# Altium schematic sheet Sheet1.SchDoc
size A; SheetNumber: 1; SheetTotal: 1
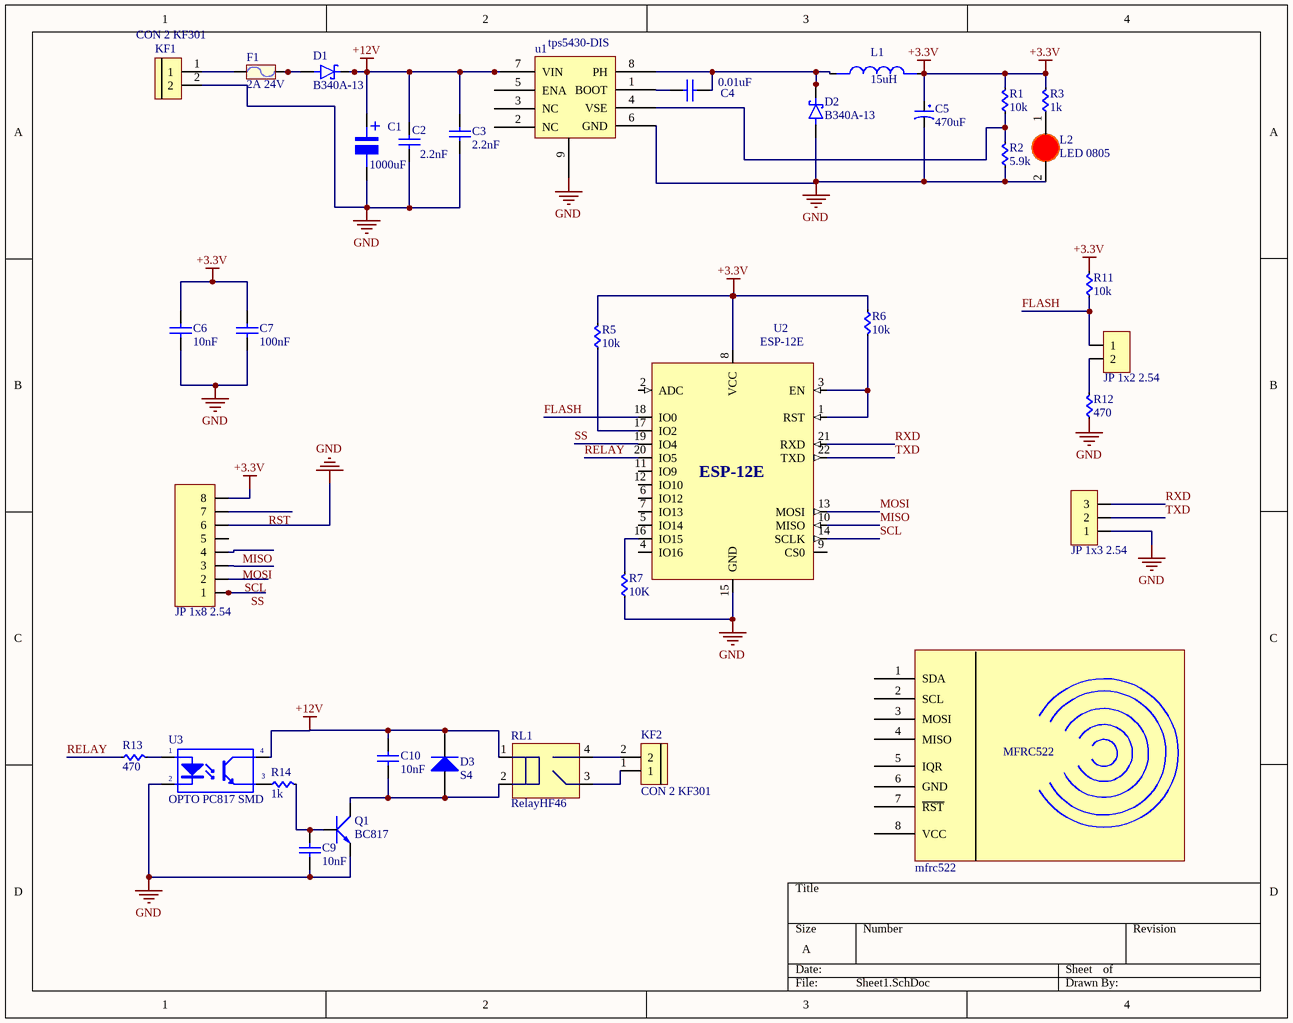
[diagram p0: Sheet1.SchDoc]

## Parts
(Parts that share a designator on the sheet are numbered #1, #2 ... from top to bottom, then left to right.)
?  mfrc522  [MFRC522]
C1  1000uF  [tu nhom 10 (G)]
C2  2.2nF  [tu 0805]
C3  2.2nF  [tu 0805]
C4  0.01uF  [tu 0805]
C5  470uF  [tu tantalum smd7343]
C6  10nF  [tu 0805]
C7  100nF  [tu 0805]
C9  10nF  [tu 0805]
C10  10nF  [tu 0805]
D1  B340A-13  [B340A]
D2  B340A-13  [B340A]
D3  S4  [DIODE SOD-123]
F1  2A 24V  [Cau chi tu phuc hoi 2A 24V SMD1812]
JP1  JP 1x3 2.54  [JP 1x3 DT]
JP?#1  JP 1x2 2.54  [JP 1x2 DT]
JP?#2  JP 1x8 2.54  [JP 1x8 DT]
KF1  CON 2 KF301  [Con 2 KF301 5.08]
KF2  CON 2 KF301  [Con 2 KF301 5.08]
L1  15uH  [CUON CAM SMD 0530]
L2  LED 0805  [LED-0805-Red]
Q1  BC817  [SOT-23]
R1  10k  [RES 0805]
R2  5.9k  [RES 0805]
R3  1k  [RES 0805]
R5  10k  [RES 0805]
R6  10k  [RES 0805]
R7  10K  [RES 0805]
R11  10k  [RES 0805]
R12  470  [RES 0805]
R13  470  [RES 0805]
R14  1k  [RES 0805]
RL1  RelayHF46  [Relay 4 chan HF46F]
u1  tps5430-DIS  [SOIC127P600X170_HS-8N]
U2  ESP-12E  [ESP-12E]
U3  OPTO PC817 SMD  [SOP4]

## Nets
+3.3V: C5.1 C6.1 C7.1 JP?#2.8 L1.2 R1.2 R3.2 R5.2 R6.1 R11.2 U2.8(VCC)
+12V: C1.1 C2.1 C3.1 C10.1 D1.C D3.2(K) RL1.1 u1.7(VIN) U3.4(C)
GND: C1.2 C2.2 C3.2 C5.2 C6.2 C7.2 C9.2 D2.A JP1.1 JP?#2.6 KF1.2 L2.2(K) Q1.2(E) R2.1 R7.1 R12.1 u1.6(GND) u1.9 U2.15(GND) U3.2(K)
FLASH: JP?#1.1 R11.1 U2.18(IO0)
MISO: JP?#2.4 U2.10(MISO)
MOSI: JP?#2.3 U2.13(MOSI)
RELAY: R13.1 U2.20(IO5)
RST: JP?#2.7
RXD: JP1.3 U2.21(RXD)
SCL: JP?#2.2 U2.14(SCLK)
SS: JP?#2.1 U2.19(IO4)
TXD: JP1.2 U2.22(TXD)
NetC4_1: C4.1 D2.C L1.1 u1.8(PH)
NetC4_2: C4.2 u1.1(BOOT)
NetC9_1: C9.1 Q1.1(B) R14.2
NetC10_2: C10.2 D3.1(A) Q1.3(C) RL1.2
NetD1_A: D1.A F1.2
NetF1_1: F1.1 KF1.1
NetJP?#1_2: JP?#1.2 R12.2
NetKF2_1: KF2.1 RL1.3(AC/DC)
NetKF2_2: KF2.2 RL1.4(AC/DC)
NetL2_1: L2.1(A) R3.1
NetR1_1: R1.1 R2.2 u1.4(VSE)
NetR5_1: R5.1 U2.17(IO2)
NetR6_2: R6.2 U2.1(RST) U2.3(EN)
NetR7_2: R7.2 U2.16(IO15)
NetR13_2: R13.2 U3.1(A)
NetR14_1: R14.1 U3.3(E)

Not connected (* = marked no-connect by the designer): ? 1(SDA) 2(SCL) 3(MOSI) 4(MISO) 5(IQR) 6(GND) 7(~{RST}) 8(VCC); JP?#2 5; u1 2(NC) 3(NC) 5(ENA); U2 2(ADC) 4(IO16) 5(IO14) 6(IO12) 7(IO13) 9(CS0) 11(IO9) 12(IO10)

## Notes on the sheet
- (in symbol mfrc522) MFRC522
- (in symbol Tu Nhom 1000uF 16V) +

## Library data of the parts
C1 = Tu Nhom 1000uF 16V: Dán; Don_Vi: Con; So_Chan: 2; Ten_Linh_Kien: Tụ Nhôm 1000uF 16V 10x10MM; Ma_Hang: MH004419; Chung_Loai: Dán; Kieu_Chan: *
C2 C3 C6 C7 C9 C10 = Tu 0805 22nF 50V 20%: Dán; Don_Vi: Con; So_Chan: 2; Ten_Linh_Kien: Tụ 0805 22nF 50V 20%; Ma_Hang: MH007857; Chung_Loai: Dán; Kieu_Chan: *
C4 = Tu 0805 15pF 50V 10%: Dán; Don_Vi: Con; So_Chan: 2; Ten_Linh_Kien: Tụ 0805 15P 10% 50V; Ma_Hang: MH004556; Chung_Loai: Dán; Kieu_Chan: *
C5 = Tu tantalum 470uF 10V SMD7343: Dán; Don_Vi: Con; So_Chan: 2; Ten_Linh_Kien: Tụ tantalum 477A-470uF 10V SMD7343; Ma_Hang: MH001956; Chung_Loai: Dán; Kieu_Chan: *
D1 D2 = B340A-13: Diode Schottky 40 V 3A Surface Mount SMA; MF: Diodes Inc.; Value: *; MP: B340A-13; Package: DO-214 Diodes Inc.; Availability: In Stock; Price: None; SnapEDA_Link: https://www.snapeda.com/parts/B340A-13/Diodes+Inc./view-part/?ref=snap; Check_prices: https://www.snapeda.com/parts/B340A-13/Diodes+Inc./view-part/?ref=eda; Purchase-URL: https://pricing.snapeda.com/search/part/B340A-13/?ref=eda
D3 = Diode S4: Dán; Ten_Linh_Kien: Diode S4 SOD123 ( 1N5819 SOD123); Ma_Hang: MH005519; Don_Vi: Con; Ghi_Chu: *; Chung_Loai: Dán; Kieu_Chan: *
F1 = Cau chi tu phuc hoi 2A 24V SMD1812: 2A 24V SMD1812; Ma_Hang: MH010033; Ten: Cầu Chì Tự Phục Hồi 2A 24V SMD1812
JP1 = JP 1x3 2.54 Duc Thang: Cắm; Ten_Linh_Kien: Jump Đơn Đực 2.54MM 1x40P Thẳng 11MM; Don_Vi: Con; Ma_Hang: MH000903; Ghi_Chu: *; Kieu_Chan: *; Chung_Loai: Cắm
JP?#1 = JP 1x2 2.54 Duc Thang: Cắm; Ten_Linh_Kien: Jump Đơn Đực 2.54MM 1x40P Thẳng 11MM; Don_Vi: Con; Ma_Hang: MH000903; Ghi_Chu: *; Kieu_Chan: *; Chung_Loai: Cắm
JP?#2 = JP 1x8 2.54 Duc Thang: Cắm; Ten_Linh_Kien: Jump Đơn Đực 2.54MM 1x40P Thẳng 11MM; Don_Vi: Con; Ma_Hang: MH000903; Ghi_Chu: *; Kieu_Chan: *; Chung_Loai: Cắm
KF1 KF2 = CON 2 KF301: Cắm; Ma_Hang: MH000987; Ten_Linh_Kien: CON 2 KF301-2P 5.08MM Xanh Dương; Chung_Loai: Cắm; Ghi_Chu: *; Kieu_Chan: *; Don_Vi: Con
L1 = Cuon Cam SMD 0530: SMD 0530; MP: FDV0530-H-1R5M=P3; Package: None; Price: None; Value: *; Availability: Unavailable
L2 = LED 0805 Do: Dán; Don_Vi: Con; Ma_Hang: MH000897; Ten_Linh_Kien: LED 0805 Màu Đỏ (Red); Ghi_Chu: *; Kieu_Chan: *; Chung_Loai: Dán
Q1 = Trans BC817: SOT-23 - C8658; Value: C9014
R1 R5-R7 R11 = RES 0805: RES SMD 0805; Manufacturer: Vishay Dale; Manufacturer Part Number: CRCW040210K0FKED; Tolerance: ±1%; Power (Watts): 0.063W, 1/16W; Temperature Coefficient: ±100ppm/°C; Supplier 1: Digi-Key; RoHS: RoHS Compliant; Category: Resistors; Stock 1: 2392462; Pricing 1: 10=0.083, 50=0.0444, 200=0.0255, 1000=0.0174 (USD); Packaging: Cut Tape (CT); Resistance (Ohms): 10k; Composition: Thick Film; Features: Automotive AEC-Q200; Operating Temperature: -55°C ~ 155°C; Package / Case: 0402 (1005 Metric); Supplier Device Package: 0402 (1005 Metric); Size / Dimension: 0.039" L x 0.020" W (1.00mm x 0.50mm); Height: 0.016" (0.40mm); Number of Terminations: 2; ComponentLink1URL: http://www.vishay.com/docs/20035/dcrcwe3.pdf; ComponentLink1Description: http://www.vishay.com/docs/20035/dcrcwe3.pdf; Supplier Part Number 1: 541-10.0KLCT-ND
R2 R3 R12-R14 = RES 0805: RES SMD 0805; Manufacturer: Vishay Dale; Manufacturer Part Number: CRCW040210K0FKED; Resistance (Ohms): 10k; Tolerance: ±1%; Power (Watts): 0.063W, 1/16W; Temperature Coefficient: ±100ppm/°C; Supplier 1: Digi-Key; RoHS: RoHS Compliant; Category: Resistors; Stock 1: 2392462; Pricing 1: 10=0.083, 50=0.0444, 200=0.0255, 1000=0.0174 (USD); Packaging: Cut Tape (CT); Composition: Thick Film; Features: Automotive AEC-Q200; Operating Temperature: -55°C ~ 155°C; Package / Case: 0402 (1005 Metric); Supplier Device Package: 0402 (1005 Metric); Size / Dimension: 0.039" L x 0.020" W (1.00mm x 0.50mm); Height: 0.016" (0.40mm); Number of Terminations: 2; ComponentLink1URL: http://www.vishay.com/docs/20035/dcrcwe3.pdf; ComponentLink1Description: http://www.vishay.com/docs/20035/dcrcwe3.pdf; Supplier Part Number 1: 541-10.0KLCT-ND
RL1 = Relay 4 chan HF46F: Ten: Relay 5V5A HF46F-G 5-HS1; Ma_Hang: MH003879
U2 = ESP-12E: ESP8266 ESP-12E Module (ESP8266, Castellated Holes); Manufacturer: AI-THINKER; Manufacturer Part Number: ESP-12E; Distributor Link: *
U3 = OPTO PC817 SMD: Single Opto; Value: PC817